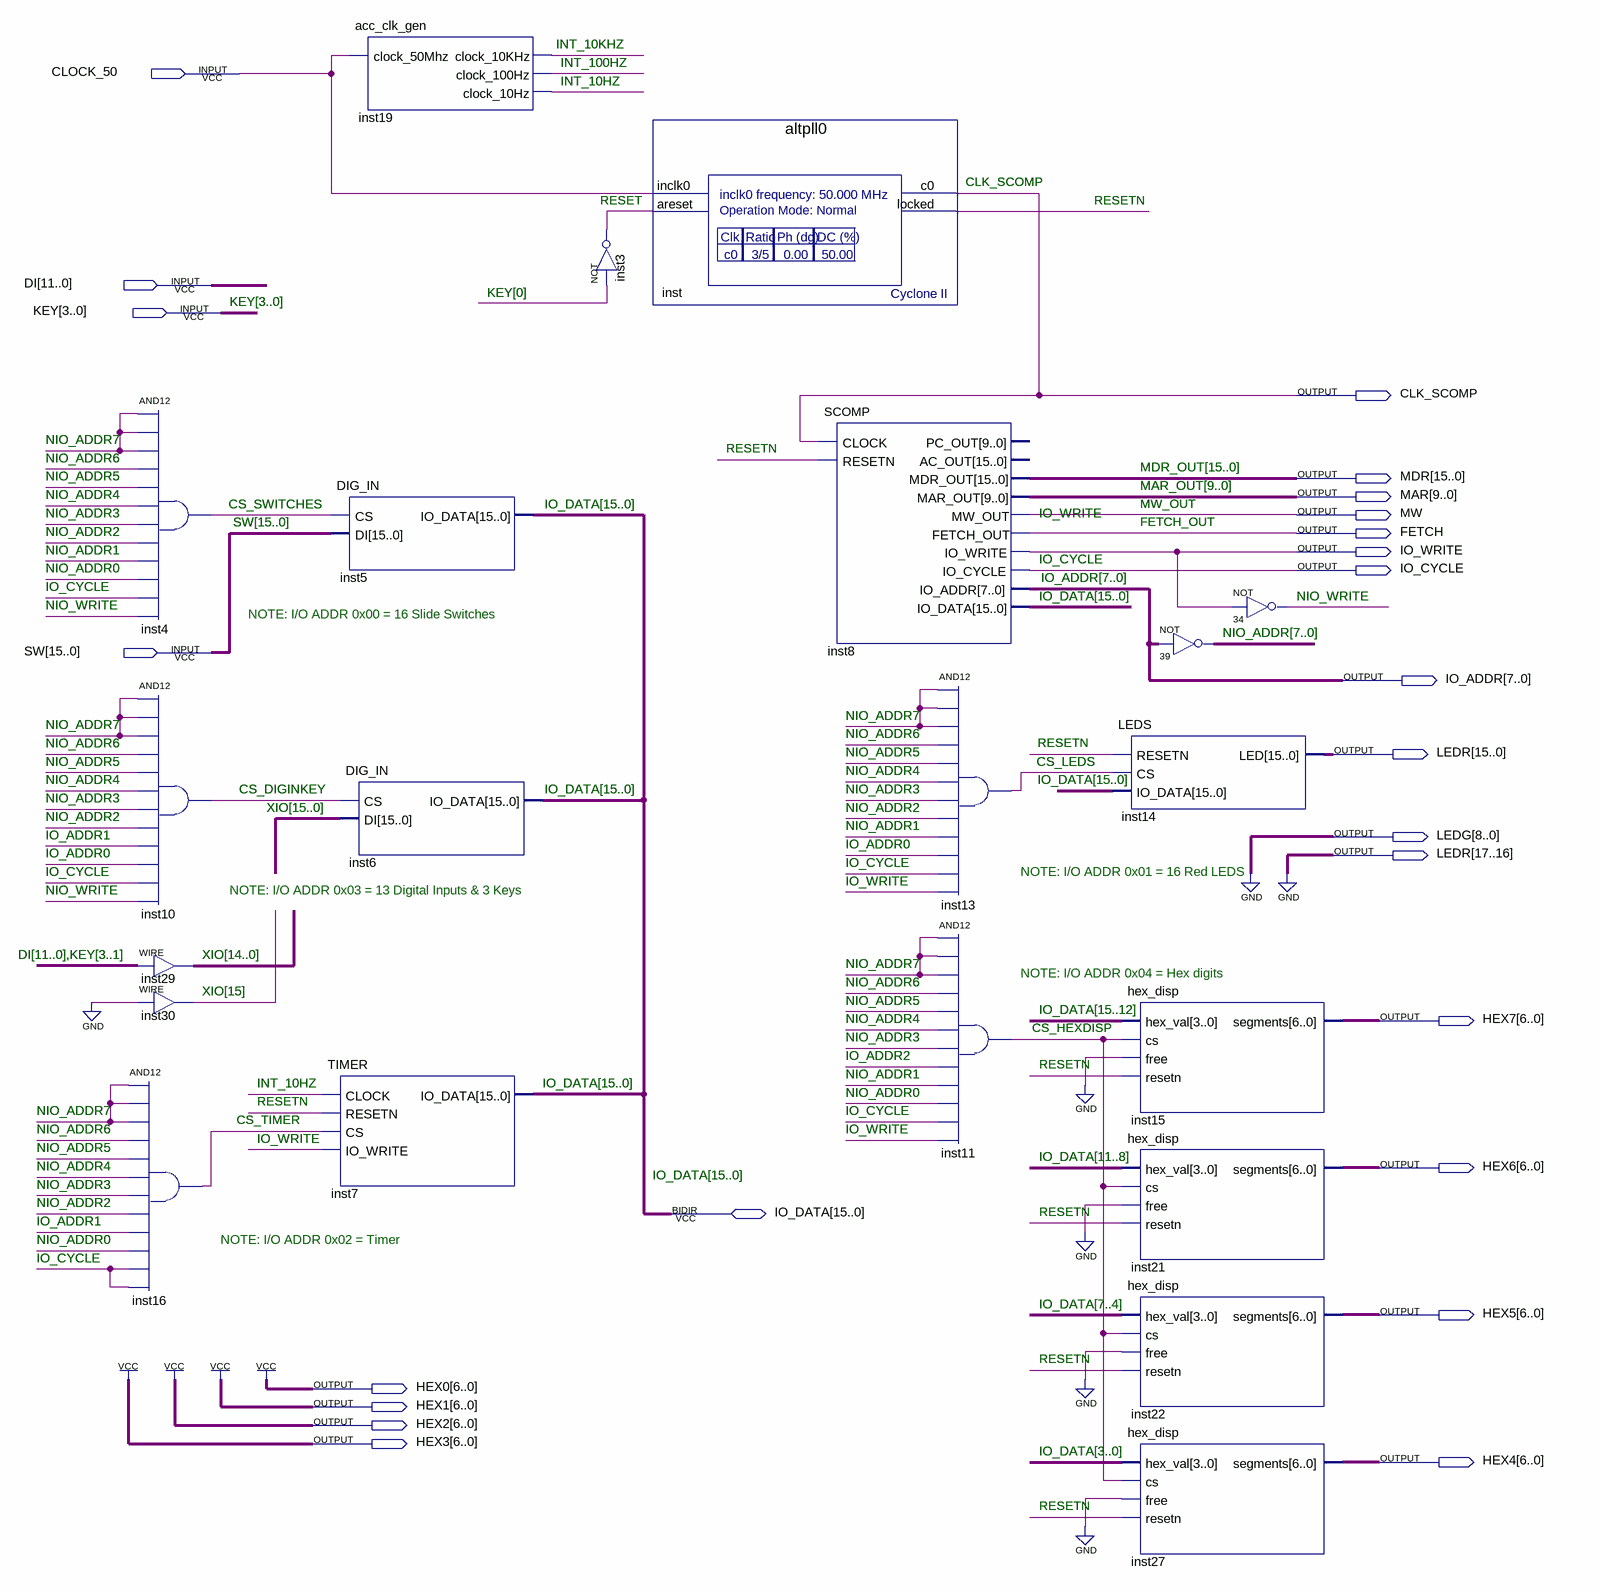
[diagram p0: schematic sheet]
// Quartus schematic top_scomp.bdf as structural Verilog: 21 symbols, 24 pins
module top_scomp (
  input  CLOCK_50,
  input  [11:0] DI,
  input  [3:0] KEY,
  input  [15:0] SW,
  inout  [15:0] IO_DATA,
  output CLK_SCOMP,
  output [15:0] MDR,
  output [9:0] MAR,
  output MW,
  output FETCH,
  output IO_WRITE,
  output IO_CYCLE,
  output [7:0] IO_ADDR,
  output [17:0] LEDR,
  output [8:0] LEDG,
  output [6:0] HEX7,
  output [6:0] HEX6,
  output [6:0] HEX5,
  output [6:0] HEX0,
  output [6:0] HEX1,
  output [6:0] HEX2,
  output [6:0] HEX3,
  output [6:0] HEX4
);

  wire CS_DIGINKEY, CS_HEXDISP, CS_LEDS, CS_SWITCHES, CS_TIMER, INT_10HZ, INT_10KHZ, INT_100HZ, NIO_WRITE,
       RESET, RESETN;
  wire [7:0] NIO_ADDR;
  wire [15:0] XIO;

  and inst4 (CS_SWITCHES, NIO_ADDR[7], NIO_ADDR[7], NIO_ADDR[7], NIO_ADDR[6], NIO_ADDR[5], NIO_ADDR[4], NIO_ADDR[3], NIO_ADDR[2], NIO_ADDR[1], NIO_ADDR[0], IO_CYCLE, NIO_WRITE);
  and inst10 (CS_DIGINKEY, NIO_ADDR[7], NIO_ADDR[7], NIO_ADDR[7], NIO_ADDR[6], NIO_ADDR[5], NIO_ADDR[4], NIO_ADDR[3], NIO_ADDR[2], IO_ADDR[1], IO_ADDR[0], IO_CYCLE, NIO_WRITE);
  assign XIO[14:0] = {DI, KEY[3:1]};  // WIRE inst29
  assign XIO[15] = 1'b0;  // WIRE inst30
  and inst16 (CS_TIMER, NIO_ADDR[7], NIO_ADDR[7], NIO_ADDR[7], NIO_ADDR[6], NIO_ADDR[5], NIO_ADDR[4], NIO_ADDR[3], NIO_ADDR[2], IO_ADDR[1], NIO_ADDR[0], IO_CYCLE, IO_CYCLE);
  acc_clk_gen inst19 (.clock_50Mhz(CLOCK_50), .clock_10KHz(INT_10KHZ), .clock_100Hz(INT_100HZ), .clock_10Hz(INT_10HZ));
  DIG_IN inst5 (.CS(CS_SWITCHES), .DI(SW), .IO_DATA(IO_DATA));
  DIG_IN inst6 (.CS(CS_DIGINKEY), .DI(XIO), .IO_DATA(IO_DATA));
  TIMER inst7 (.CLOCK(INT_10HZ), .RESETN(RESETN), .CS(CS_TIMER), .IO_WRITE(IO_WRITE), .IO_DATA(IO_DATA));
  not inst3 (RESET, KEY[0]);
  altpll0 inst (.inclk0(CLOCK_50), .areset(RESET), .c0(CLK_SCOMP), .locked(RESETN));
  SCOMP inst8 (
    .CLOCK(CLK_SCOMP), .RESETN(RESETN), .MDR_OUT(MDR), .MAR_OUT(MAR), .MW_OUT(MW), .FETCH_OUT(FETCH),
    .IO_WRITE(IO_WRITE), .IO_CYCLE(IO_CYCLE), .IO_ADDR(IO_ADDR), .IO_DATA(IO_DATA));  // open: PC_OUT, AC_OUT
  and inst13 (CS_LEDS, NIO_ADDR[7], NIO_ADDR[7], NIO_ADDR[7], NIO_ADDR[6], NIO_ADDR[5], NIO_ADDR[4], NIO_ADDR[3], NIO_ADDR[2], NIO_ADDR[1], IO_ADDR[0], IO_CYCLE, IO_WRITE);
  and inst11 (CS_HEXDISP, NIO_ADDR[7], NIO_ADDR[7], NIO_ADDR[7], NIO_ADDR[6], NIO_ADDR[5], NIO_ADDR[4], NIO_ADDR[3], IO_ADDR[2], NIO_ADDR[1], NIO_ADDR[0], IO_CYCLE, IO_WRITE);
  assign NIO_ADDR = ~IO_ADDR;  // NOT 39, 8 bits wide
  LEDS inst14 (.RESETN(RESETN), .CS(CS_LEDS), .IO_DATA(IO_DATA), .LED(LEDR[15:0]));
  hex_disp inst15 (.hex_val(IO_DATA[15:12]), .cs(CS_HEXDISP), .free(1'b0), .resetn(RESETN), .segments(HEX7));
  hex_disp inst21 (.hex_val(IO_DATA[11:8]), .cs(CS_HEXDISP), .free(1'b0), .resetn(RESETN), .segments(HEX6));
  hex_disp inst22 (.hex_val(IO_DATA[7:4]), .cs(CS_HEXDISP), .free(1'b0), .resetn(RESETN), .segments(HEX5));
  hex_disp inst27 (.hex_val(IO_DATA[3:0]), .cs(CS_HEXDISP), .free(1'b0), .resetn(RESETN), .segments(HEX4));
  not u_34 (NIO_WRITE, IO_WRITE);

  assign HEX0 = {7{1'b1}};
  assign HEX1 = {7{1'b1}};
  assign HEX2 = {7{1'b1}};
  assign HEX3 = {7{1'b1}};
  assign LEDG = {9{1'b0}};
  assign LEDR[17:16] = 2'b00;

  // Other names for the same wires on the sheet: FETCH_OUT = FETCH; MAR_OUT[9:0] = MAR; MDR_OUT[15:0] = MDR;
  //   MW_OUT = MW

  // Notes on the sheet:
  //   INT_10KHZ
  //   INT_100HZ
  //   INT_10HZ
  //   CLK_SCOMP
  //   RESET
  //   RESETN
  //   KEY[0]
  //   KEY[3..0]
  //   NIO_ADDR7
  //   RESETN
  //   NIO_ADDR6
  //   MDR_OUT[15..0]
  //   NIO_ADDR5
  //   MAR_OUT[9..0]
  //   NIO_ADDR4
  //   CS_SWITCHES
  //   IO_DATA[15..0]
  //   MW_OUT
  //   NIO_ADDR3
  //   IO_WRITE
  //   SW[15..0]
  //   FETCH_OUT
  //   NIO_ADDR2
  //   NIO_ADDR1
  //   IO_CYCLE
  //   NIO_ADDR0
  //   IO_ADDR[7..0]
  //   IO_CYCLE
  //   IO_DATA[15..0]
  //   NIO_WRITE
  //   NIO_WRITE
  //   NOTE: I/O ADDR 0x00 = 16 Slide Switches
  //   NIO_ADDR[7..0]
  //   NIO_ADDR7
  //   NIO_ADDR7
  //   NIO_ADDR6
  //   NIO_ADDR6
  //   RESETN
  //   NIO_ADDR5
  //   NIO_ADDR5
  //   CS_LEDS
  //   NIO_ADDR4
  //   NIO_ADDR4
  //   IO_DATA[15..0]
  //   CS_DIGINKEY
  //   IO_DATA[15..0]
  //   NIO_ADDR3
  //   NIO_ADDR3
  //   XIO[15..0]
  //   NIO_ADDR2
  //   NIO_ADDR2
  //   NIO_ADDR1
  //   IO_ADDR1
  //   IO_ADDR0
  //   IO_ADDR0
  //   IO_CYCLE
  //   IO_CYCLE
  //   NOTE: I/O ADDR 0x01 = 16 Red LEDS
  //   IO_WRITE
  //   NIO_WRITE
  //   NOTE: I/O ADDR 0x03 = 13 Digital Inputs & 3 Keys
  //   DI[11..0],KEY[3..1]
  //   XIO[14..0]
  //   NIO_ADDR7
  //   NOTE: I/O ADDR 0x04 = Hex digits
  //   NIO_ADDR6
  //   XIO[15]
  //   NIO_ADDR5
  //   IO_DATA[15..12]
  //   NIO_ADDR4
  //   CS_HEXDISP
  //   NIO_ADDR3
  //   IO_ADDR2
  //   RESETN
  //   NIO_ADDR1
  //   INT_10HZ
  //   IO_DATA[15..0]
  //   NIO_ADDR0
  //   RESETN
  //   NIO_ADDR7
  //   IO_CYCLE
  //   CS_TIMER
  //   NIO_ADDR6
  //   IO_WRITE
  //   IO_WRITE
  //   NIO_ADDR5
  //   IO_DATA[11..8]
  //   NIO_ADDR4
  //   IO_DATA[15..0]
  //   NIO_ADDR3
  //   NIO_ADDR2
  //   RESETN
  //   IO_ADDR1
  //   NIO_ADDR0
  //   NOTE: I/O ADDR 0x02 = Timer
  //   IO_CYCLE
  //   IO_DATA[7..4]
  //   RESETN
  //   IO_DATA[3..0]
  //   RESETN
endmodule
